# Altium schematic sheet SH3-FTDI.SchDoc: SH3_FTDI
size Letter; DrawnBy: Christopher Arjune; SheetNumber: 3; SheetTotal: 4
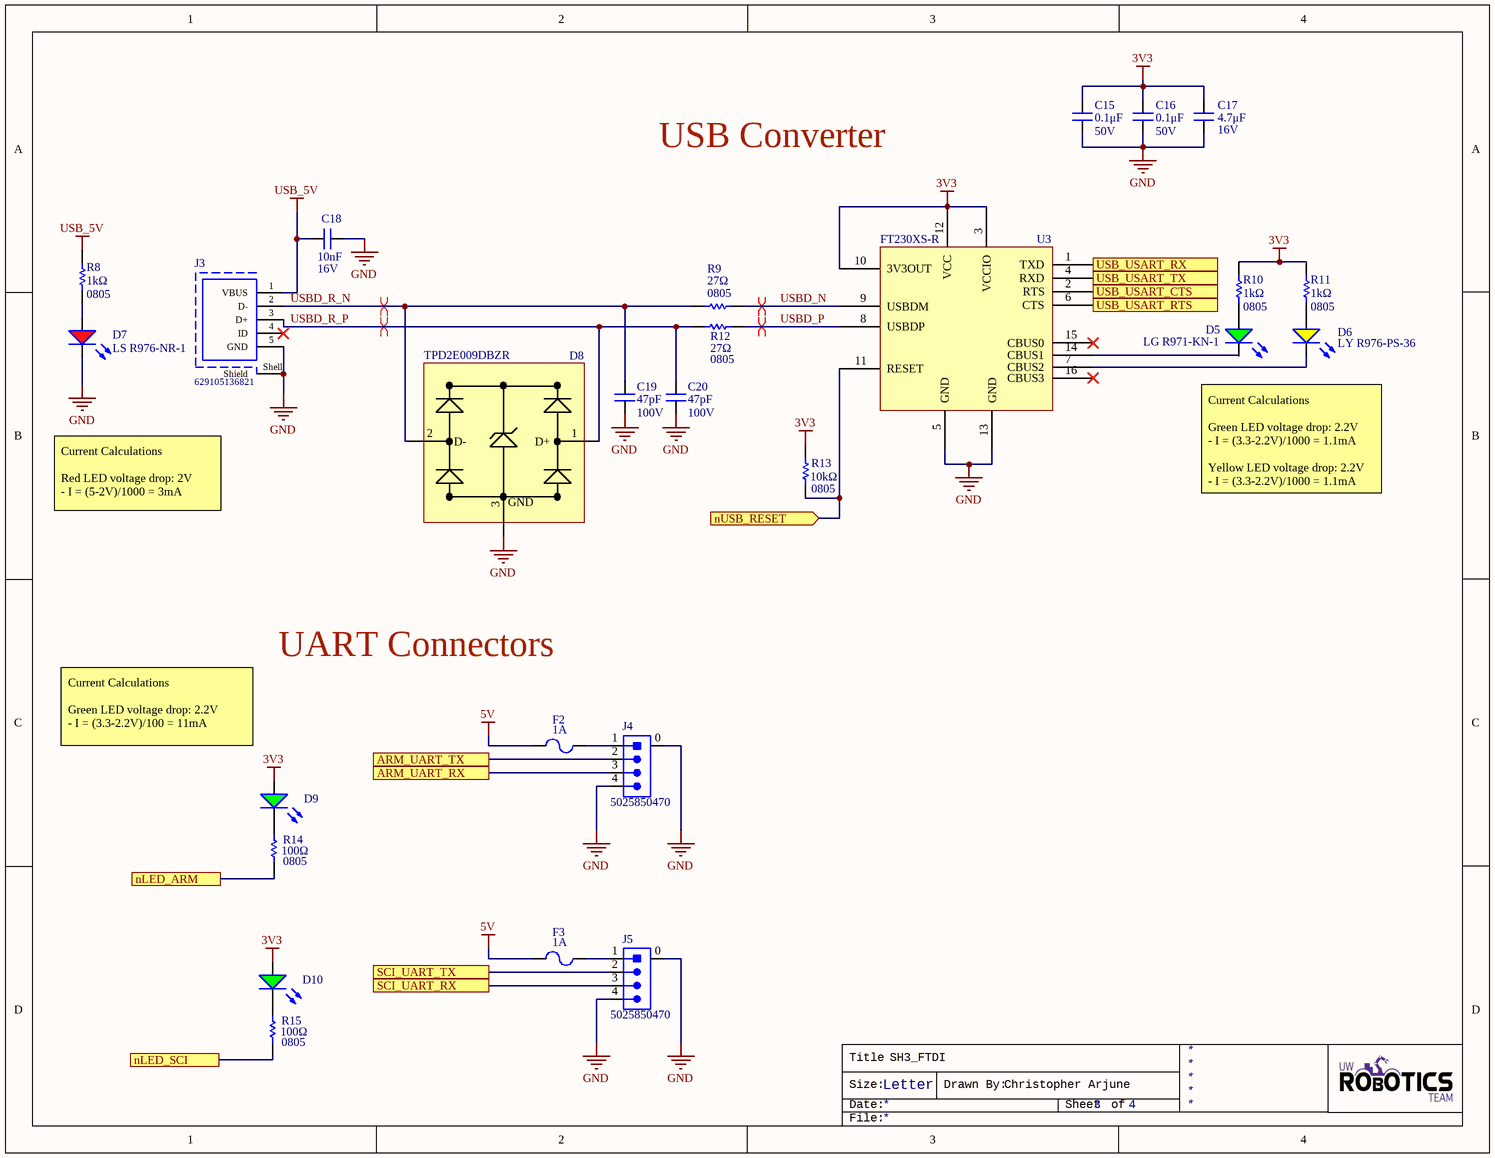
[diagram p0: SH3-FTDI.SchDoc]

## Parts
C15  0.1μF  Voltage Rating: 50V  [CAPC2012X140N]
C16  0.1μF  Voltage Rating: 50V  [CAPC2012X140N]
C17  value 4.7μF  Voltage Rating: 16V  [CAPC2012X140N]
C18  Capacitance: 10nF  Voltage Rating: 16V  [CAPC2012X140N]
C19  Capacitance: 47pF  Voltage Rating: 100V  [CAPC2012X140N]
C20  Capacitance: 47pF  Voltage Rating: 100V  [CAPC2012X140N]
D5  LG R971-KN-1  [LED_0805_LINE]
D6  LY R976-PS-36  [LED_0805_LINE]
D7  LS R976-NR-1  [LED_0805_LINE]
D8  Manufacturer Part Number: TPD2E009DBZR  [SOT23-3]  (hidden comment: TVS_DIODE_USB_5.5V)
D9  LG R971-KN-1  [LED_0805_LINE]  (value not drawn)
D10  LG R971-KN-1  [LED_0805_LINE]  (value not drawn)
F2  Current Rating: 1A  [FUSC3215X78N]  (hidden comment: FUSE_1A_1206)
F3  Current Rating: 1A  [FUSC3215X78N]  (hidden comment: FUSE_1A_1206)
J3  629105136821  [629105136821]
J4  Manufactor Number: 5025850470  [MOLEX-5025850470]  (hidden comment: CON_4M_SM_RA)
J5  Manufactor Number: 5025850470  [MOLEX-5025850470]  (hidden comment: CON_4M_SM_RA)
R8  1kΩ  Case Code (Imperial): 0805  [RESC2012X60N]
R9  Case/Package: 0805  Resistance: 27Ω  [RESC2012X60N]  (hidden comment: RES_27Ω_0805)
R10  1kΩ  Case Code (Imperial): 0805  [RESC2012X60N]
R11  1kΩ  Case Code (Imperial): 0805  [RESC2012X60N]
R12  Case/Package: 0805  Resistance: 27Ω  [RESC2012X60N]  (hidden comment: RES_27Ω_0805)
R13  value 10kΩ  Case Code (Imperial): 0805  [RESC2012X60N]  (hidden comment: RES_10kΩ_0805)
R14  value 100Ω  Case Code (Imperial): 0805  [RESC2012X60N]  (hidden comment: RES_100Ω_0805)
R15  value 100Ω  Case Code (Imperial): 0805  [RESC2012X60N]  (hidden comment: RES_100Ω_0805)
U3  Manufacturer Part Number 1: FT230XS-R  [SSOP16-0.635-5X4MM]  (hidden comment: IC_USB_TRANSCEIVER)

## Ports
ARM_UART_RX, ARM_UART_TX, nLED_ARM, nLED_SCI, nUSB_RESET (in), SCI_UART_RX, SCI_UART_TX, USB_USART_CTS (out), USB_USART_RTS (in), USB_USART_RX (out), USB_USART_TX (in)

## Nets
3V3: C15.2 C16.2 C17.2 D9.1(A) D10.1(A) R10.2 R11.2 R13.2 U3.3(VCCIO) U3.10(3V3OUT) U3.12(VCC)
5V: F2.1 F3.1
GND: C15.1 C16.1 C17.1 C18.2 C19.2 C20.2 D7.2(K) D8.3(GND) J3.5(GND) J3.Shell(Shield) J4.0 J4.4 J5.0 J5.4 U3.5(GND) U3.13(GND)
USB_5V: C18.1 J3.1(VBUS) R8.2
ARM_UART_RX: J4.3 ; port ARM_UART_RX
ARM_UART_TX: J4.2 ; port ARM_UART_TX
nLED_ARM: R14.1 ; port nLED_ARM
nLED_SCI: R15.1 ; port nLED_SCI
nUSB_RESET: R13.1 U3.11(RESET) ; port nUSB_RESET
SCI_UART_RX: J5.3 ; port SCI_UART_RX
SCI_UART_TX: J5.2 ; port SCI_UART_TX
USB_USART_CTS: U3.2(RTS) ; port USB_USART_CTS
USB_USART_RTS: U3.6(CTS) ; port USB_USART_RTS
USB_USART_RX: U3.1(TXD) ; port USB_USART_RX
USB_USART_TX: U3.4(RXD) ; port USB_USART_TX
USBD_N: R9.2 U3.9(USBDM)
USBD_P: R12.2 U3.8(USBDP)
USBD_R_N: C19.1 D8.2(D-) J3.2(D-) R9.1
USBD_R_P: C20.1 D8.1(D+) J3.3(D+) R12.1
NetD5_1: D5.1(A) R10.1
NetD5_2: D5.2(K) U3.14(CBUS1)
NetD6_1: D6.1(A) R11.1
NetD6_2: D6.2(K) U3.7(CBUS2)
NetD7_1: D7.1(A) R8.1
NetD9_2: D9.2(K) R14.2
NetD10_2: D10.2(K) R15.2
NetF2_2: F2.2 J4.1
NetF3_2: F3.2 J5.1

Not connected (* = marked no-connect by the designer): J3 4(ID)*; U3 15(CBUS0)* 16(CBUS3)*

## Layout directives
differential pair: USBD_N, USBD_P, USBD_R_N, USBD_R_P

## Notes on the sheet
- USB Converter
- Current Calculations
  Red LED voltage drop: 2V
  - I = (5-2V)/1000 = 3mA
- Current Calculations
  Green LED voltage drop: 2.2V
  - I = (3.3-2.2V)/1000 = 1.1mA
  Yellow LED voltage drop: 2.2V
  - I = (3.3-2.2V)/1000 = 1.1mA
- UART Connectors
- (near D9) Current Calculations
  Green LED voltage drop: 2.2V
  - I = (3.3-2.2V)/100 = 11mA
- Title
- Size:
- Date:
- Letter
- Drawn By:
- Sheet
- of
- File:

## Library data of the parts
C15 C16 = CAP_0.1uF_50V_0805: CAP CER 0.1UF 50V X7R 0805; Manufacturer 1: Murata Electronics; Manufacturer Part Number 1: GCD21BR71H104KA01L; Tolerance: 10%; Mount: Surface Mount; Case Code (Metric): 2012; Case Code (Imperial): 0805; Min Operating Temperature: -55°C; Max Operating Temperature: 125°C; Dielectric: X7R; Termination: SMD/SMT; Length: 2mm; Height: 1.25mm; Width: 0.049inch; Thickness: 0.049inch; Depth: 1.25mm; Ratings: AEC-Q200; Supplier 1: Digi-Key; Supplier Part Number 1: 490-11955-1-ND; Package: 0805 (2012 Metric); Value: 0.1μF
C17 = CAP_4.7uF_16V_0805: CAP CER 4.7UF 16V X5R 0805; Manufacturer 1: Samsung Electro-Mechanics; Manufacturer Part Number 1: CL21A475KOFNNNE; Tolerance: 10%; Mount: Surface Mount; Case Code (Metric): 2012; Case Code (Imperial): 0805; Min Operating Temperature: -55°C; Max Operating Temperature: 85°C; Dielectric: X5R; Termination: SMD/SMT; Supplier 1: Digi-Key; Supplier Part Number 1: 1276-1065-1-ND; Package: 0805 (2012 Metric)
C18 = CAP_10nF_16V_0805: CAP CER 10000PF 16V X7R 0805; Manufacturer 1: Yageo; Manufacturer Part Number 1: AC0805KRX7R7BB103; Tolerance: 10%; Supplier 1: Digi-Key; Stock 1: 14344; Pricing 1: 1=0.20000, 10=0.13900, 100=0.07060, 500=0.04832, 1000=0.04275 (USD); RoHS: No; Mount: Surface Mount; Case/Package: 0805; Case Code (Imperial): 0805; Case Code (Metric): 2012; Min Operating Temperature: -55°C; Max Operating Temperature: 125°C; Packaging: Cut Tape; Ratings: AEC-Q200; ComponentLink1URL: http://www.yageo.com/NewPortal/_en/search/productDocs.jsp?YageoPartNumber=AC0805KRX7R7BB103&src-supplier=Digi-Key; ComponentLink1Description: http://www.yageo.com/NewPortal/_en/search/productDocs.jsp?YageoPartNumber=AC0805KRX7R7BB103&src-supplier=Digi-Key; Supplier Part Number 1: 311-3161-1-ND
C19 C20 = CAP_47pF_100V_0805: CAP CER 47PF 100V NPO 0805; Manufacturer 1: Yageo; Manufacturer Part Number 1: AC0805JRNPO0BN470; Tolerance: 5%; Supplier 1: Digi-Key; Stock 1: 2091; Pricing 1: 1=0.19000, 10=0.12600, 100=0.06400, 500=0.04376, 1000=0.03871 (USD); RoHS: No; Mount: Surface Mount; Case/Package: 0805; Case Code (Imperial): 0805; Case Code (Metric): 2012; Min Operating Temperature: -55°C; Max Operating Temperature: 125°C; Packaging: Tape and Reel; Ratings: AEC-Q200; ComponentLink1URL: http://www.yageo.com/NewPortal/_en/search/productDocs.jsp?YageoPartNumber=AC0805JRNPO0BN470&src-supplier=Digi-Key; ComponentLink1Description: http://www.yageo.com/NewPortal/_en/search/productDocs.jsp?YageoPartNumber=AC0805JRNPO0BN470&src-supplier=Digi-Key; Supplier Part Number 1: 311-3131-1-ND
D5 D9 D10 = DIO_LED_G: LED GREEN DIFFUSED 0805 SMD; Manufacturer 1: OSRAM; Forward Voltage Drop: 2.2V; Package: 0805 (2012 Metric); Manufacturer Part Number 1: LG R971-KN-1; Supplier Part Number 1: 475-1410-1-ND; Supplier 1: Digi-Key; Mount: Surface Mount
D6 = DIO_LED_Y: LED YELLOW DIFFUSED 0805 SMD; Manufacturer 1: OSRAM; Forward Voltage Drop: 2.2V; Package: 0805 (2012 Metric); Manufacturer Part Number 1: LY R976-PS-36; Supplier Part Number 1: 475-2560-1-ND; Supplier 1: Digi-Key; Mount: Surface Mount
D7 = DIO_LED_R: LED RED DIFFUSED 0805 SMD; Manufacturer 1: OSRAM; Forward Voltage Drop: 2V; Package: 0805 (2012 Metric); Manufacturer Part Number 1: LS R976-NR-1; Supplier Part Number 1: 475-1278-1-ND; Supplier 1: Digi-Key; Mount: Surface Mount
D8 = TVS_DIODE_USB_5.5V: ESD Suppressor Diode Arrays 8KV 3-Pin SOT-23 T/R; Manufacturer: Texas Instruments; Direction: Unidirectional; Operating Supply Voltage: 6V; Capacitance: 0.9pF; Number of Channels: 2; Current Rating: 100nA; Peak Pulse Current: 1A; Element Configuration: Dual; Reverse Standoff Voltage: 5.5V; Min Breakdown Voltage: 9V; Clamping Voltage: 8V; Peak Pulse Power: 45W; Power Line Protection: Yes; Breakdown Voltage: 7V; Interface: LVDS,PCIe,SATA; Supplier 1: Digi-Key; RoHS: Yes; Category: Interface ICs; Stock 1: 98615; Pricing 1: 1=0.56000, 10=0.48000, 25=0.44800, 100=0.33280, 250=0.31616, 500=0.25984, 1000=0.21120 (USD); Case/Package: SOT-23; Number of Pins: 3; Min Operating Temperature: -40°C; Max Operating Temperature: 85°C; Packaging: Tape and Reel; Package Quantity: 1; Number of Bidirectional Channels: 2; Termination: SMD/SMT; Max Power Dissipation: 45W; Working Voltage: 5.5V; Length: 2.92mm; Height: 1mm; Width: 1.3mm; Depth: 1.3mm; Radiation Hardening: No; REACH SVHC: No SVHC; Lead Free: Lead Free; ComponentLink1URL: https://datasheet.ciiva.com/353/tpd2e009-353266.pdf?src-supplier=Digi-Key; ComponentLink1Description: https://datasheet.ciiva.com/353/tpd2e009-353266.pdf?src-supplier=Digi-Key; ComponentLink2URL: https://datasheet.ciiva.com/15134/getdatasheetpartid-243395-15134537.pdf?src-supplier=Verical; ComponentLink2Description: https://datasheet.ciiva.com/15134/getdatasheetpartid-243395-15134537.pdf?src-supplier=Verical; ComponentLink3URL: https://datasheet.ciiva.com/4479/slvs953a-121037-4479453.pdf?src-supplier=Mouser; ComponentLink3Description: https://datasheet.ciiva.com/4479/slvs953a-121037-4479453.pdf?src-supplier=Mouser; ComponentLink4URL: https://datasheet.ciiva.com/353/tpd2e009-353268.pdf?src-supplier=Digi-Key; ComponentLink4Description: https://datasheet.ciiva.com/353/tpd2e009-353268.pdf?src-supplier=Digi-Key; ComponentLink5URL: https://datasheet.ciiva.com/353/tpd2e009-353267.pdf?src-supplier=Digi-Key; ComponentLink5Description: https://datasheet.ciiva.com/353/tpd2e009-353267.pdf?src-supplier=Digi-Key; ComponentLink6URL: https://datasheet.ciiva.com/46384/1707898-46384524.pdf?src-supplier=Element14; ComponentLink6Description: https://datasheet.ciiva.com/46384/1707898-46384524.pdf?src-supplier=Element14; Supplier Part Number 1: 296-24657-1-ND
F2 F3 = FUSE_1A_1206: FUSE BOARD MOUNT 1A 125VAC 63VDC; Manufacturer 1: Bel Fuse Inc.; Manufacturer Part Number 1: C1Q 1; Voltage Rating DC: 63V; Supplier 1: Digi-Key; Supplier Part Number 1: 507-1077-1-ND; Mount: Surface Mount
J3 = CMP-1502-03253-1: Micro USB 2.0 Type B Receptacle WR-COM, Horizontal, SMT, with Pads and Pegs; Manufacturer: Wurth Elektronik; Contact Resistance: 30mOhm; Rated Current: 1A; Working Voltage: 30VAC; Datasheet URL: https://katalog.we-online.de/em/datasheet/629105136821.pdf; Mounting Technology: SMT; Publisher: WurthElektronik; Package Reference: 629105136821; Orientation: Horizontal; Packaging: TapeandReel; Part Number: 629105136821; Manufacturer URL: http://www.we-online.de; Connector Type: MicroUSB2.0TypeB; Gender: Receptacle; Operating Temperature: -40to105degC
J4 J5 = CON_4M_SM_RA: CONN HEADER SMD RIGHT ANGLE 1.5 MM PITCH; Manufacturer: Molex; Supplier 1: Digi-Key; Supplier Part Number 1: WM9449CT-ND
R8 R10 R11 = RES_1kΩ_0805: RES SMD 1K OHM 1% 1/8W 0805; Manufacturer 1: Yageo; Manufacturer Part Number 1: RC0805FR-071KL; Power Rating: 125mW; Temperature Coefficient: 25ppm/°C; Voltage Rating: 150V; Supplier 1: Digi-Key; Case Code (Metric): 2012; Min Operating Temperature: -55°C; Max Operating Temperature: 155°C; Resistance: 1K; Tolerance: 1%; Termination: SMD/SMT; Supplier Part Number 1: 311-1.00KCRCT-ND; Package: 0805 (2012 Metric); Value: 1kΩ; RoHS: Yes; Mount: Surface Mount; Case/Package: 0805; Number of Pins: 2; Weight: 0.000194oz; Contact Plating: Tin; Packaging: Tape and Reel; Composition: Thin Film; Number of Terminations: 2; Voltage Rating (DC): 150V; Max Power Dissipation: 125mW; Package Quantity: 1000; Features: Moisture Resistant,Automotive AEC-Q200,Anti-Sulfur; Military Standard: Not; Length: 2mm; Height: 0.022inch; Width: 0.049inch; Depth: 1.25mm; Radiation Hardening: No; Lead Free: Lead Free; REACH SVHC: Unknown; ComponentLink1URL: https://datasheet.ciiva.com/9003/tnpw-e3-9003481.pdf?src-supplier=Avnet; ComponentLink1Description: https://datasheet.ciiva.com/9003/tnpw-e3-9003481.pdf?src-supplier=Avnet; ComponentLink2URL: https://datasheet.ciiva.com/9003/tnpw-e3-9003543.pdf?src-supplier=Avnet; ComponentLink2Description: https://datasheet.ciiva.com/9003/tnpw-e3-9003543.pdf?src-supplier=Avnet
R9 R12 = RES_27Ω_0805: RES SMD 27 OHM 1% 1/8W 0805; Manufacturer 1: Yageo; Manufacturer Part Number 1: RC0805FR-0727RL; Temperature Coefficient: 100ppm/°C; Working Voltage: 150V; Power Rating: 125mW; Supplier 1: Digi-Key; Stock 1: 345388; Pricing 1: 1=0.10000, 10=0.04000, 100=0.01630, 1000=0.00731, 2500=0.00635 (USD); RoHS: Yes; Case Code (Imperial): 0805; Case Code (Metric): 2012; Min Operating Temperature: -55°C; Max Operating Temperature: 155°C; Tolerance: 1%; Composition: Thick Film; Packaging: Tape and Reel; Number of Terminations: 2; Termination: SMD/SMT; Voltage Rating: 150V; Military Standard: Not; Length: 2mm; Height: 0.5mm; Width: 1.25mm; Depth: 1.25mm; REACH SVHC: Unknown; Lead Free: Lead Free; ComponentLink1URL: https://datasheet.ciiva.com/12561/rc0805-257173-12561222.pdf?src-supplier=Mouser; ComponentLink1Description: https://datasheet.ciiva.com/12561/rc0805-257173-12561222.pdf?src-supplier=Mouser; ComponentLink2URL: https://datasheet.ciiva.com/7941/444164-7941752.pdf?src-supplier=Element14; ComponentLink2Description: https://datasheet.ciiva.com/7941/444164-7941752.pdf?src-supplier=Element14; ComponentLink3URL: https://datasheet.ciiva.com/7941/444164-7941753.pdf?src-supplier=Element14; ComponentLink3Description: https://datasheet.ciiva.com/7941/444164-7941753.pdf?src-supplier=Element14; Supplier Part Number 1: 311-27.0CRCT-ND
R13 = RES_10kΩ_0805: RES SMD 10K OHM 1% 1/8W 0805; Manufacturer 1: Yageo; Manufacturer Part Number 1: RC0805FR-0710KL; Power Rating: 125mW; Supplier 1: Digi-Key; Case Code (Metric): 2012; Min Operating Temperature: -55°C; Max Operating Temperature: 155°C; Resistance: 10K; Tolerance: 1%; Termination: SMD/SMT; Supplier Part Number 1: 311-10.0KCRCT-ND; Package: 0805 (2012 Metric)
R14 R15 = RES_100Ω_0805: RES SMD 100 OHM 1% 1/8W 0805; Manufacturer 1: Yageo; Manufacturer Part Number 1: RC0805FR-07100RL; Power Rating: 125mW; Supplier 1: Digi-Key; Mount: Surface Mount; Case Code (Metric): 2012; Supplier Part Number 1: 311-100CRCT-ND; Package: 0805 (2012 Metric)
U3 = IC_USB_TRANSCEIVER: Manufacturer 1: FTDI, Future Technology Devices International Ltd; Supplier 1: Digi-Key; Supplier Part Number 1: 768-1135-1-ND